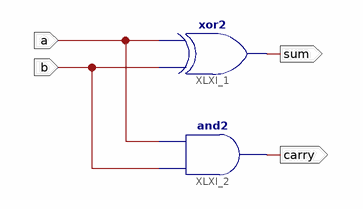
[diagram p0: schematic sheet 1]
// Xilinx ISE schematic ha.sch (xc9500) as structural Verilog: 2 symbols, 4 ports
module ha (
  input  a,
  input  b,
  output sum,
  output carry
);

  xor XLXI_1 (sum, b, a);
  and XLXI_2 (carry, b, a);
endmodule
